# EAGLE design bin_watch (EAGLE 8.4.2)
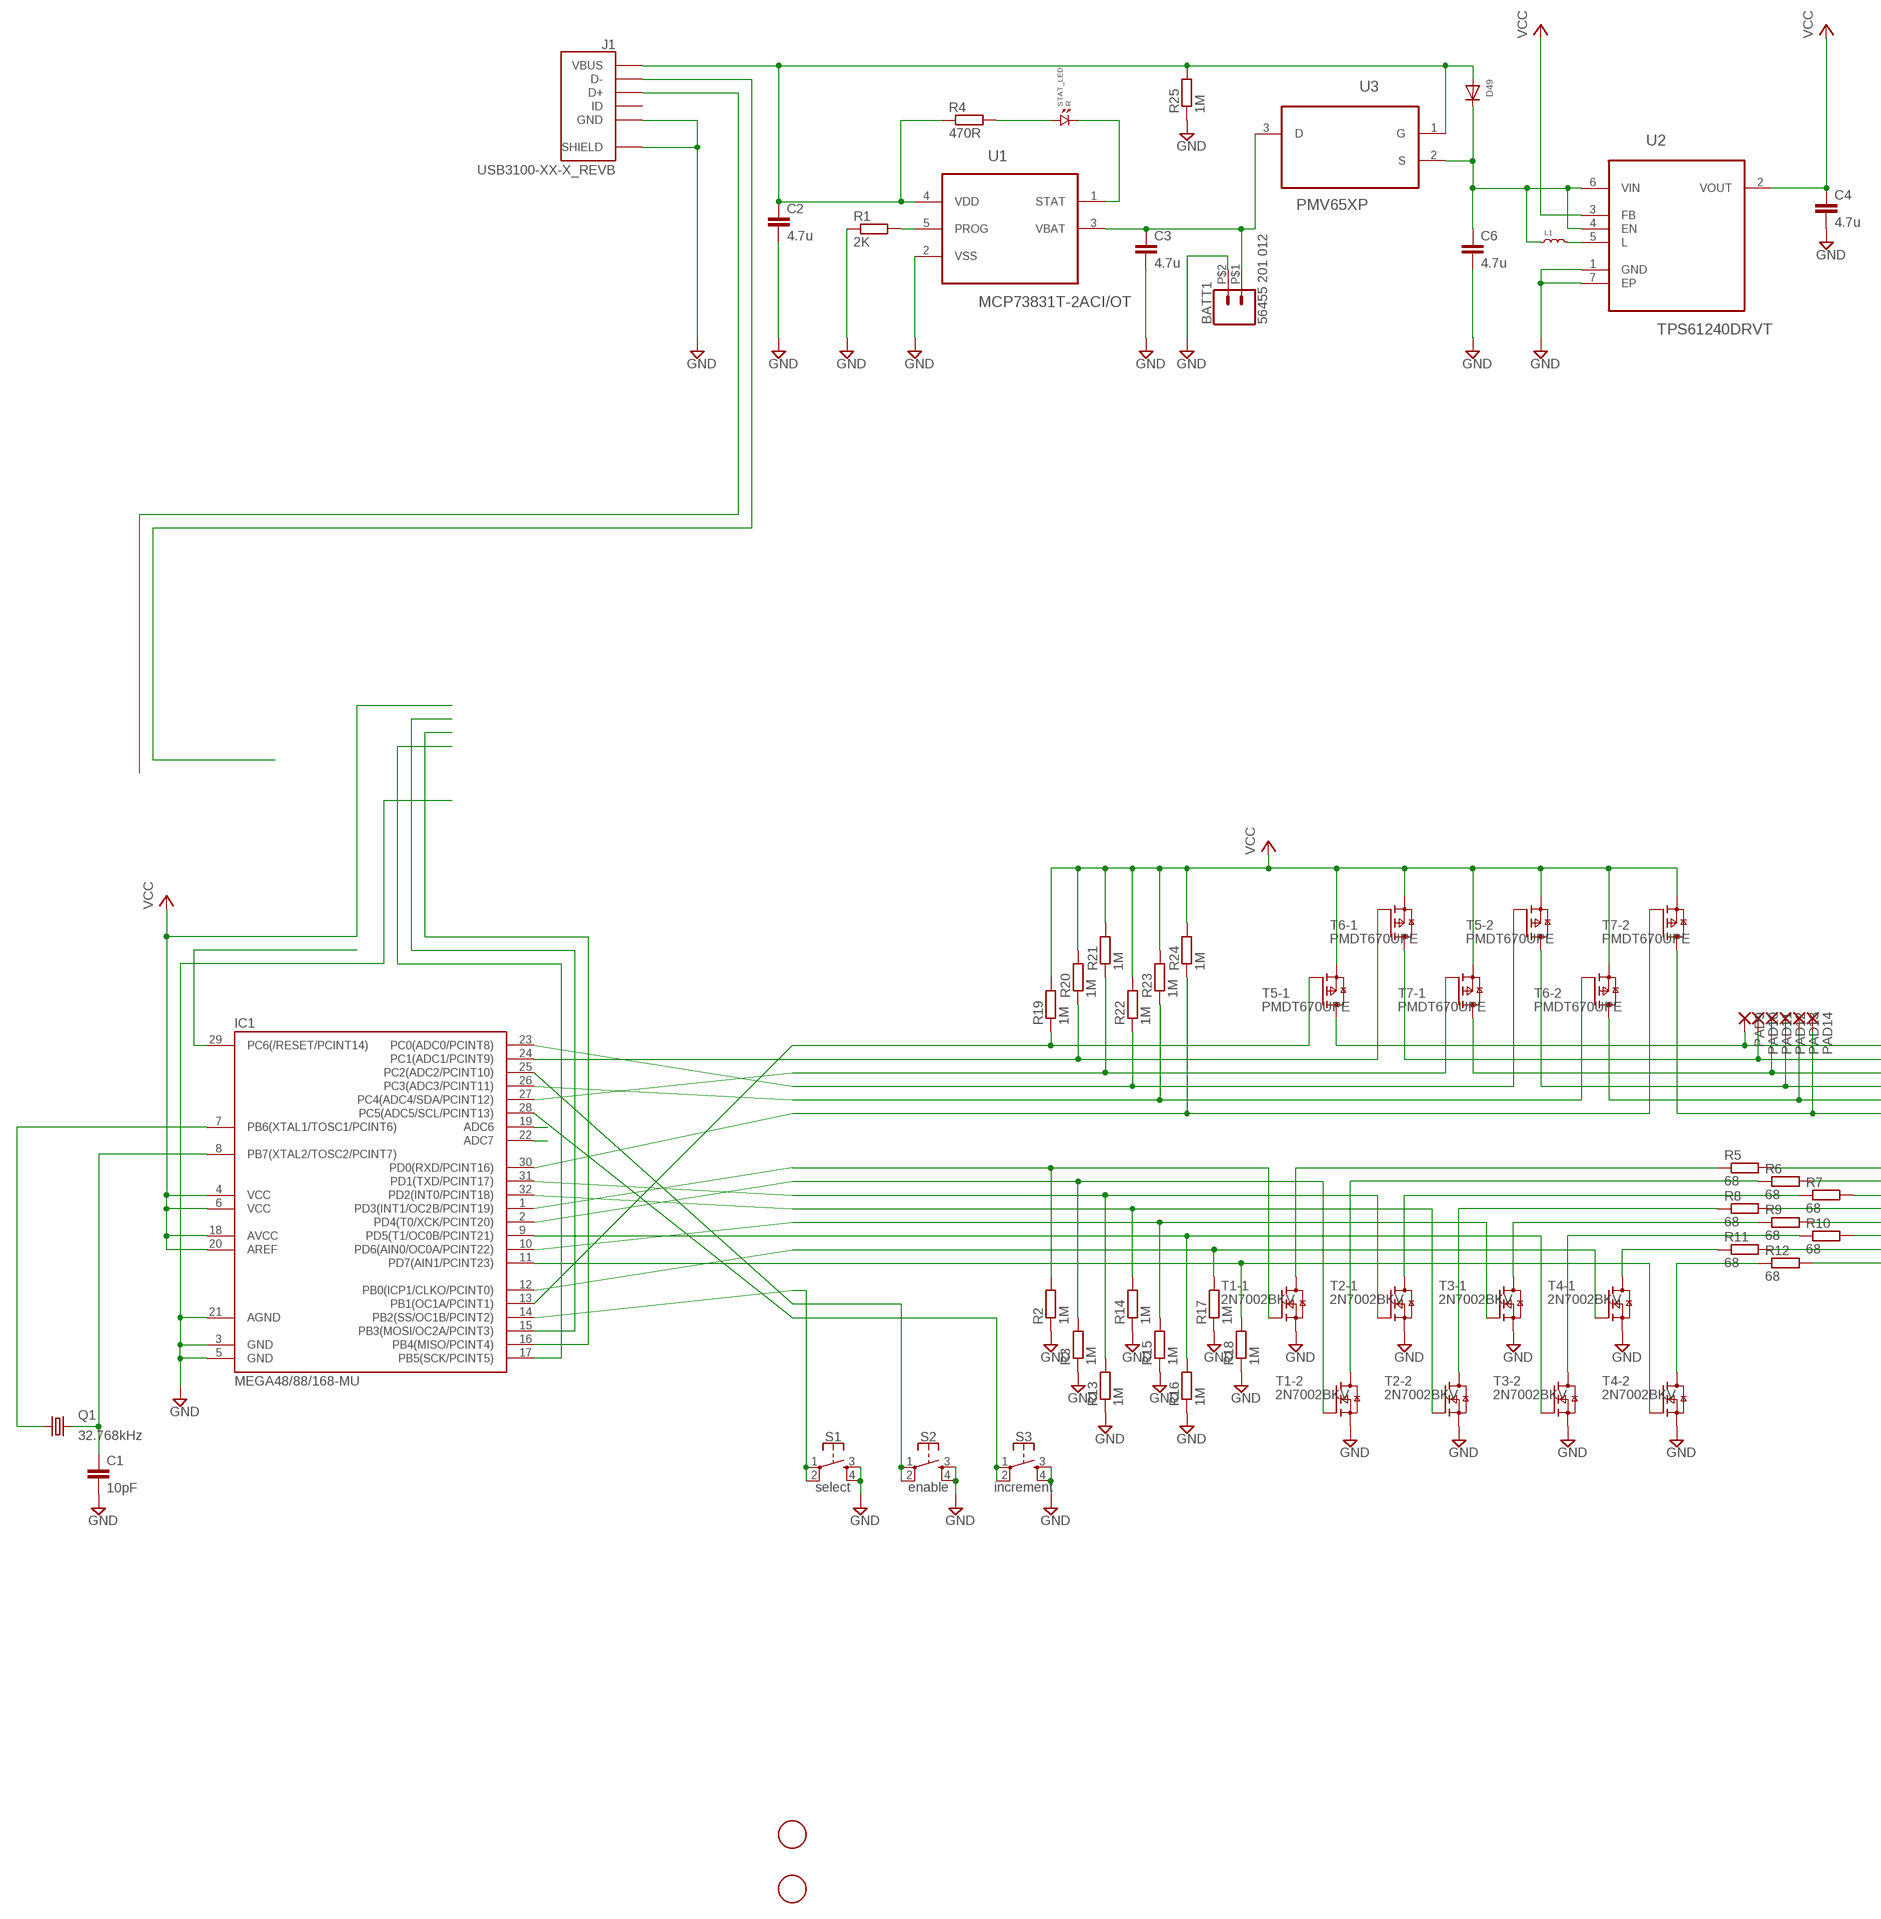
[diagram p0: schematic, sheet 1, part 1 of 2]
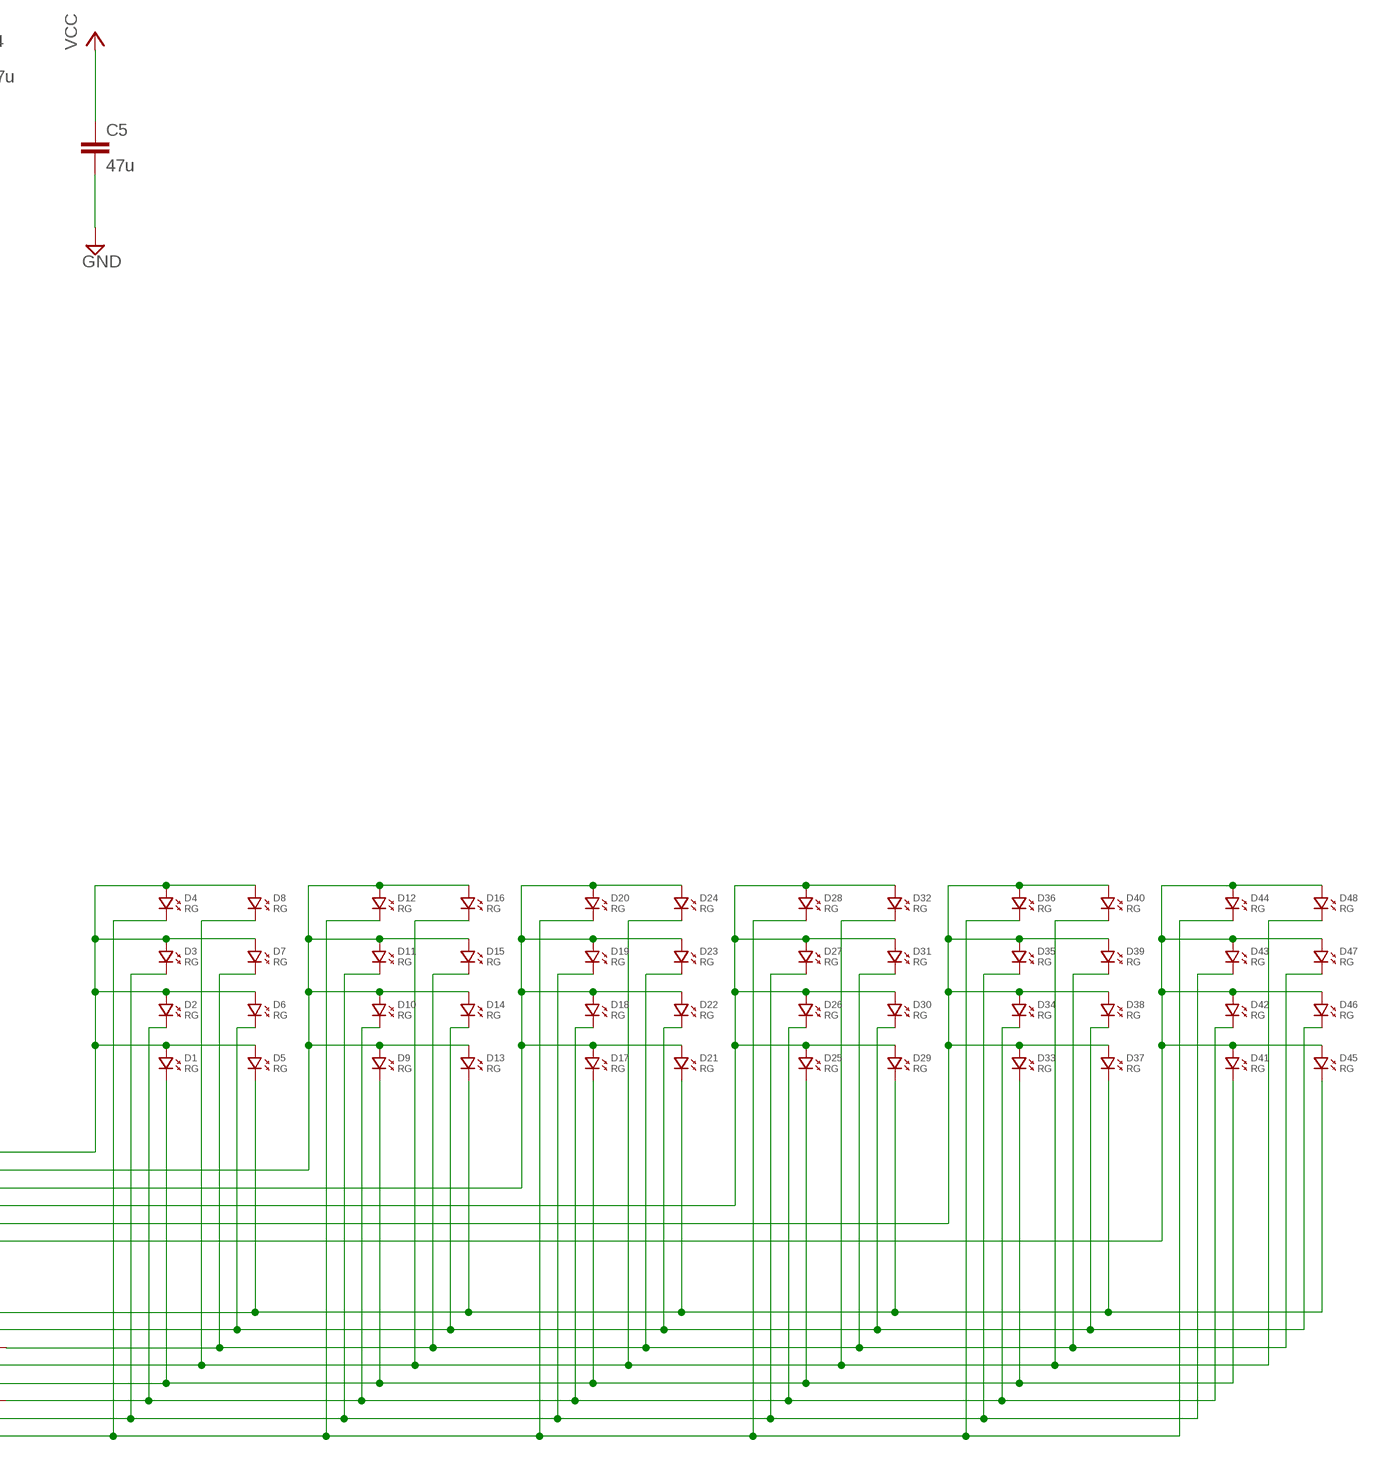
[diagram p1: schematic, sheet 1, part 2 of 2]

## Parts
BATT1  56455 201 012  CONN_02PTH2  [1X02_BIG]
C1  10pF  C-EUC0603  [C0603]
C2  4.7u  C-EUC0603  [C0603]
C3  4.7u  C-EUC0603  [C0603]
C4  4.7u  C-EUC0603  [C0603]
C5  47u  C-EUC0603  [C0603]
C6  4.7u  C-EUC0603  [C0603]
D1  RG  LED.0603  [0603.LED]
D2  RG  LED.0603  [0603.LED]
D3  RG  LED.0603  [0603.LED]
D4  RG  LED.0603  [0603.LED]
D5  RG  LED.0603  [0603.LED]
D6  RG  LED.0603  [0603.LED]
D7  RG  LED.0603  [0603.LED]
D8  RG  LED.0603  [0603.LED]
D9  RG  LED.0603  [0603.LED]
D10  RG  LED.0603  [0603.LED]
D11  RG  LED.0603  [0603.LED]
D12  RG  LED.0603  [0603.LED]
D13  RG  LED.0603  [0603.LED]
D14  RG  LED.0603  [0603.LED]
D15  RG  LED.0603  [0603.LED]
D16  RG  LED.0603  [0603.LED]
D17  RG  LED.0603  [0603.LED]
D18  RG  LED.0603  [0603.LED]
D19  RG  LED.0603  [0603.LED]
D20  RG  LED.0603  [0603.LED]
D21  RG  LED.0603  [0603.LED]
D22  RG  LED.0603  [0603.LED]
D23  RG  LED.0603  [0603.LED]
D24  RG  LED.0603  [0603.LED]
D25  RG  LED.0603  [0603.LED]
D26  RG  LED.0603  [0603.LED]
D27  RG  LED.0603  [0603.LED]
D28  RG  LED.0603  [0603.LED]
D29  RG  LED.0603  [0603.LED]
D30  RG  LED.0603  [0603.LED]
D31  RG  LED.0603  [0603.LED]
D32  RG  LED.0603  [0603.LED]
D33  RG  LED.0603  [0603.LED]
D34  RG  LED.0603  [0603.LED]
D35  RG  LED.0603  [0603.LED]
D36  RG  LED.0603  [0603.LED]
D37  RG  LED.0603  [0603.LED]
D38  RG  LED.0603  [0603.LED]
D39  RG  LED.0603  [0603.LED]
D40  RG  LED.0603  [0603.LED]
D41  RG  LED.0603  [0603.LED]
D42  RG  LED.0603  [0603.LED]
D43  RG  LED.0603  [0603.LED]
D44  RG  LED.0603  [0603.LED]
D45  RG  LED.0603  [0603.LED]
D46  RG  LED.0603  [0603.LED]
D47  RG  LED.0603  [0603.LED]
D48  RG  LED.0603  [0603.LED]
D49  DIODESOD-523  [SOD-523]
IC1  MEGA48/88/168-MU  [MLF32]
J1  USB3100-XX-X_REVB  [GCT_USB3100-XX-X_REVB]
L1  RF-INDUCTOR.0805  [0805]
PAD9  SMD2  [SMD1,27-2,54]
PAD10  SMD2  [SMD1,27-2,54]
PAD11  SMD2  [SMD1,27-2,54]
PAD12  SMD2  [SMD1,27-2,54]
PAD13  SMD2  [SMD1,27-2,54]
PAD14  SMD2  [SMD1,27-2,54]
Q1  32.768kHz  KX-327-NHF  [3.2X1.5]
R1  2K  R-EU_R0603  [R0603]
R2  1M  R-EU_R0603  [R0603]
R3  1M  R-EU_R0603  [R0603]
R4  470R  R-EU_R0603  [R0603]
R5  68  R-EU_R0603  [R0603]
R6  68  R-EU_R0603  [R0603]
R7  68  R-EU_R0603  [R0603]
R8  68  R-EU_R0603  [R0603]
R9  68  R-EU_R0603  [R0603]
R10  68  R-EU_R0603  [R0603]
R11  68  R-EU_R0603  [R0603]
R12  68  R-EU_R0603  [R0603]
R13  1M  R-EU_R0603  [R0603]
R14  1M  R-EU_R0603  [R0603]
R15  1M  R-EU_R0603  [R0603]
R16  1M  R-EU_R0603  [R0603]
R17  1M  R-EU_R0603  [R0603]
R18  1M  R-EU_R0603  [R0603]
R19  1M  R-EU_R0603  [R0603]
R20  1M  R-EU_R0603  [R0603]
R21  1M  R-EU_R0603  [R0603]
R22  1M  R-EU_R0603  [R0603]
R23  1M  R-EU_R0603  [R0603]
R24  1M  R-EU_R0603  [R0603]
R25  1M  R-EU_R0603  [R0603]
S1  select  MOMENTARY-SWITCH-SPST-2-SMD-5.2MM  [TACTILE_SWITCH_SMD_5.2MM]
S2  enable  MOMENTARY-SWITCH-SPST-2-SMD-5.2MM  [TACTILE_SWITCH_SMD_5.2MM]
S3  increment  MOMENTARY-SWITCH-SPST-2-SMD-5.2MM  [TACTILE_SWITCH_SMD_5.2MM]
STAT_LED  R  LED.0603  [0603.LED]
T1  2N7002BKV  [SOT666]
T2  2N7002BKV  [SOT666]
T3  2N7002BKV  [SOT666]
T4  2N7002BKV  [SOT666]
T5  PMDT670UPE  [SOT666]
T6  PMDT670UPE  [SOT666]
T7  PMDT670UPE  [SOT666]
U1  MCP73831T-2ACI/OT  [SOT95P280X145-5N]
U2  TPS61240DRVT  [SON65P200X200X80-7N]
U3  PMV65XP  PMV48XP  [SOT95P230X110-3N]
U$1  FIDUCIAL  [FIDUCIAL_1MM]
U$2  FIDUCIAL  [FIDUCIAL_1MM]

## Nets
ADC6: IC1.19(ADC6)
ADC7: IC1.22(ADC7)
BLOCK0 [pwr]: D1.P$1 D2.P$1 D3.P$1 D4.P$1 D5.P$1 D6.P$1 D7.P$1 D8.P$1 PAD9.1(P) T5.6(-1:D)
BLOCK1 [pwr]: D9.P$1 D10.P$1 D11.P$1 D12.P$1 D13.P$1 D14.P$1 D15.P$1 D16.P$1 PAD10.1(P) T6.6(-1:D)
BLOCK2 [pwr]: D17.P$1 D18.P$1 D19.P$1 D20.P$1 D21.P$1 D22.P$1 D23.P$1 D24.P$1 PAD11.1(P) T7.6(-1:D)
BLOCK3 [pwr]: D25.P$1 D26.P$1 D27.P$1 D28.P$1 D29.P$1 D30.P$1 D31.P$1 D32.P$1 PAD12.1(P) T5.3(-2:D)
BLOCK4 [pwr]: D33.P$1 D34.P$1 D35.P$1 D36.P$1 D37.P$1 D38.P$1 D39.P$1 D40.P$1 PAD13.1(P) T6.3(-2:D)
BLOCK5 [pwr]: D41.P$1 D42.P$1 D43.P$1 D44.P$1 D45.P$1 D46.P$1 D47.P$1 D48.P$1 PAD14.1(P) T7.3(-2:D)
BTN1 [signal]: IC1.14(PB2(SS/OC1B/PCINT2)) S1.1 S1.2
BTN2 [signal]: IC1.25(PC2(ADC2/PCINT10)) S2.1 S2.2
BTN3 [signal]: IC1.28(PC5(ADC5/SCL/PCINT13)) S3.1 S3.2
D_N [signal]: J1.2(D-)
D_P [signal]: J1.3(D+)
G_BLOCK0 [signal]: IC1.13(PB1(OC1A/PCINT1)) R19.1 T5.2(-1:G)
G_BLOCK1 [signal]: IC1.24(PC1(ADC1/PCINT9)) R20.1 T6.2(-1:G)
G_BLOCK2 [signal]: IC1.27(PC4(ADC4/SDA/PCINT12)) R21.1 T7.2(-1:G)
G_BLOCK3 [signal]: IC1.23(PC0(ADC0/PCINT8)) R22.1 T5.5(-2:G)
G_BLOCK4 [signal]: IC1.26(PC3(ADC3/PCINT11)) R23.1 T6.5(-2:G)
G_BLOCK5 [signal]: IC1.30(PD0(RXD/PCINT16)) R24.1 T7.5(-2:G)
G_LIGHT0 [signal]: IC1.1(PD3(INT1/OC2B/PCINT19)) R2.2 T1.2(-1:G)
G_LIGHT1 [signal]: IC1.2(PD4(T0/XCK/PCINT20)) R3.2 T1.5(-2:G)
G_LIGHT2 [signal]: IC1.31(PD1(TXD/PCINT17)) R13.2 T2.2(-1:G)
G_LIGHT3 [signal]: IC1.32(PD2(INT0/PCINT18)) R14.2 T2.5(-2:G)
G_LIGHT4 [signal]: IC1.10(PD6(AIN0/OC0A/PCINT22)) R15.2 T3.2(-1:G)
G_LIGHT5 [signal]: IC1.9(PD5(T1/OC0B/PCINT21)) R16.2 T3.5(-2:G)
G_LIGHT6 [signal]: IC1.12(PB0(ICP1/CLKO/PCINT0)) R17.2 T4.2(-1:G)
G_LIGHT7 [signal]: IC1.11(PD7(AIN1/PCINT23)) R18.2 T4.5(-2:G)
GND [supply]: BATT1.P$2 C1.2 C2.2 C3.2 C4.2 C5.2 C6.2 IC1.3(GND) IC1.5(GND) IC1.21(AGND) J1.5(GND) J1.6(SHIELD) J1.7(SHIELD) J1.8(SHIELD) J1.9(SHIELD) R1.1 R2.1 R3.1 R13.1 R14.1 R15.1 R16.1 R17.1 R18.1 R25.1 S1.3 S1.4 S2.3 S2.4 S3.3 S3.4 T1.1(-1:S) T1.4(-2:S) T2.1(-1:S) T2.4(-2:S) T3.1(-1:S) T3.4(-2:S) T4.1(-1:S) T4.4(-2:S) U1.2(VSS) U2.1(GND) U2.7(EP)
L [pwr]: L1.2 U2.5(L)
LIGHT0: D5.P$2 D13.P$2 D21.P$2 D29.P$2 D37.P$2 D45.P$2 R5.2
LIGHT1: D6.P$2 D14.P$2 D22.P$2 D30.P$2 D38.P$2 D46.P$2 R6.2
LIGHT2: D7.P$2 D15.P$2 D23.P$2 D31.P$2 D39.P$2 D47.P$2 R7.2
LIGHT3: D8.P$2 D16.P$2 D24.P$2 D32.P$2 D40.P$2 D48.P$2 R8.2
LIGHT4: D1.P$2 D9.P$2 D17.P$2 D25.P$2 D33.P$2 D41.P$2 R9.2
LIGHT5: D2.P$2 D10.P$2 D18.P$2 D26.P$2 D34.P$2 D42.P$2 R10.2
LIGHT6: D3.P$2 D11.P$2 D19.P$2 D27.P$2 D35.P$2 D43.P$2 R11.2
LIGHT7: D4.P$2 D12.P$2 D20.P$2 D28.P$2 D36.P$2 D44.P$2 R12.2
MISO [signal]: IC1.16(PB4(MISO/PCINT4))
MOSI [signal]: IC1.15(PB3(MOSI/OC2A/PCINT3))
PROG [signal]: R1.2 U1.5(PROG)
R_LIGHT0: R5.1 T1.6(-1:D)
R_LIGHT1: R6.1 T1.3(-2:D)
R_LIGHT2: R7.1 T2.6(-1:D)
R_LIGHT3: R8.1 T2.3(-2:D)
R_LIGHT4: R9.1 T3.6(-1:D)
R_LIGHT5: R10.1 T3.3(-2:D)
R_LIGHT6: R11.1 T4.6(-1:D)
R_LIGHT7: R12.1 T4.3(-2:D)
RST [signal]: IC1.29(PC6(/RESET/PCINT14))
SCK [signal]: IC1.17(PB5(SCK/PCINT5))
STAT: STAT_LED.P$2 U1.1(STAT)
STAT_R: R4.2 STAT_LED.P$1
VBATT [supply]: BATT1.P$1 C3.1 U1.3(VBAT) U3.3(D)
VBUS [supply]: C2.1 D49.A J1.1(VBUS) R4.1 R25.2 U1.4(VDD) U3.1(G)
VCC [supply]: C4.1 C5.1 IC1.4(VCC) IC1.6(VCC) IC1.18(AVCC) IC1.20(AREF) R19.2 R20.2 R21.2 R22.2 R23.2 R24.2 T5.1(-1:S) T5.4(-2:S) T6.1(-1:S) T6.4(-2:S) T7.1(-1:S) T7.4(-2:S) U2.2(VOUT) U2.3(FB)
VIN [supply]: C6.1 D49.K(C) L1.1 U2.4(EN) U2.6(VIN) U3.2(S)
XTAL_N [clock]: C1.1 IC1.8(PB7(XTAL2/TOSC2/PCINT7)) Q1.2
XTAL_P [clock]: IC1.7(PB6(XTAL1/TOSC1/PCINT6)) Q1.1
Unconnected: J1.4(ID)

## Library data of the parts
BATT1 = SparkFun-Connectors:CONN_02: Multi connection point. Often used as Generic Header-pin footprint for 0.1 inch spaced/style header connections On any of the 0.1 inch spaced packages, you can populate with these: Break Away Headers - Straight <https://www.sparkfun.com/products/116> (PRT-00116) Break Away Male Headers - Right Angle <https://www.sparkfun.com/products/553> (PRT-00553) Female Headers <https://www.sparkfun.com/products/115> (PRT-00115) Break Away Headers - Machine Pin <https://www.sparkfun.com/products/117> (PRT-00117) Break Away Female Headers - Swiss Machine Pin <https://www.sparkfun.com/products/743> (PRT-00743) For SCREWTERMINALS and SPRING TERMINALS visit here: Screw Terimnals on SparkFun.com <https://www.sparkfun.com/search/results?term=Screw+Terminals> (5mm/3.5mm/2.54mm spacing) This device is also useful as a general connection point to wire up your design to another part of your project. Our various solder wires solder well into these plated through hole pads. Hook-Up Wire - Assortment (Stranded, 22 AWG) <https://www.sparkfun.com/products/11375> (PRT-11375) Hook-Up Wire - Assortment (Solid Core, 22 AWG) <https://www.sparkfun.com/products/11367> (PRT-11367) View the entire wire category on our website here <https://www.sparkfun.com/categories/141> Special notes: Molex polarized connector foot print use with: PRT-08233 with associated crimp pins and housings. 2.54_SCREWTERM for use with PRT-10571. 3.5mm Screw Terminal footprints for PRT-08084 5mm Screw Terminal footprints for use with PRT-08432
C1-C6 = rcl:C-EU: CAPACITOR, European symbol
D1-D48 STAT_LED = standardparts:LED
D49 = adafruit:DIODE: Diode SMADIODE - SMA Surface Mount Package 20V 1A Schottky Diode Digikey: 641-1014-6-ND DO-1N4148 - Through Hole Small Current Diode SOD-123 20V 1 A (.5mV Vf) Schottky Diode - Digikey: MBRX120TPMSCT-ND SOD-323 10V 570mA (.38mV Vf, 3ns) Schottky Diode - Digikey: ZLLS410CT-ND SOD-523 30V 30mA Schottky Diode (RB751S-40TE61) - Digikey: RB751S-40TE61CT-ND SOT23-R/W - SOT23 Package (R = Solder Paste/Reflow Ovens, W = Hand-Soldering) BAT54Film 40V 300mA - Digikey: 497-7162-1-ND
IC1 = avr-5:MEGA48/88/168
J1 = USB3100-XX-X_REVB:USB3100-XX-X_REVB: Micro USB Receptacle, Type B, Surface Mount, Horizontal, Top (Reverse) Mount, without Peg; AVAILABILITY: Good; DESCRIPTION: USB3100 Series 5 Pin SMT Right Angle Top Mount Micro USB Receptacle; MF: Global Connector Technology; MP: USB3100-30-A; PACKAGE: None; PRICE: 0.39 USD
L1 = standardparts:RF-INDUCTOR
PAD9-PAD14 = wirepad:SMD2: SMD PAD
Q1 = crystal-geyer_V1_0:KX-327: Tuning Fork Crystals (kHz) SMD: KX327 - Serie Model Size l/w/h [mm] Frequency Range Frequency Stability Temp. Range [°C] Load Capacitance AECQ 200 availabel Datasheet KX-327VT KX-327FT KX-327RT KX-327NHT KX-327NHF KX-327L KX-327S 1.25/1.05/0.5 1.6/1.0/0.5 2.0/1.2/0.6 3.2/1.5/0.8 3.2/1.5/0.8 7.0/1.5/1.4 8.2/3.8/2.5 32,768 kHz 32,768 kHz 32,768 kHz 32,768 kHz 32,768 kHz 32,768 kHz 32,768 kHz ±10 … ±20ppm ±10 … ±20ppm ±10 … ±20ppm ±10 … ±20ppm ±10 … ±20ppm ±10 … ±20ppm ±5 … ±20ppm (*) -40°C …+85°C (*) -40°C …+85°C (*) -40°C …+85°C (*) -40°C …+85°C (*) -40°C …+125°C (*) -40°C …+85°C (*) -40°C …+85°C 7/9/12,5 7/9/12,5 7/9/12,6 7/9/12,5 9/12,5 7/9/12,5 6/12,5 - - - - yes - - KX-327VT.pdf <http://www.geyer-electronic.de/uploads/tx_userartikelfrequenz/GEYER-KX-327VT.pdf> KX-327FT.pdf <http://www.geyer-electronic.de/uploads/tx_userartikelfrequenz/GEYER-KX-327FT.pdf> KX-327RT.pdf <http://www.geyer-electronic.de/uploads/tx_userartikelfrequenz/GEYER-KX-327RT.pdf> KX-327NHT.pdf <http://www.geyer-electronic.de/uploads/tx_userartikelfrequenz/GEYER-KX-327NHT.pdf> KX-327NHF.pdf <http://www.geyer-electronic.de/uploads/tx_userartikelfrequenz/GEYER-KX-327NHF.pdf> KX-327L.pdf <http://www.geyer-electronic.de/uploads/tx_userartikelfrequenz/GEYER-KX-327L.pdf> KX-327S.pdf <http://www.geyer-electronic.de/uploads/tx_userartikelfrequenz/GEYER-KX-327S.pdf> <http://www.geyer-electronic.de/fileadmin/template/img/logo-geyer-electronic.png> Details see: http://www.geyer-electronic.de/Frequenz-Produkte.9.0.html Created 2016-06-07, Hans Locher 2016 (C) Geyer Quartz Technology KX327VT,KX327FT,KX327RT,KX327NHT,KX327NHF,KX327S,KX327L;125105;1610;2012;3215;7015;8238;1,25x1,05,1.25x1.05;1,6x1,0,1.6x1.0;2,0x1,2,2.0x1.2;3,2x1,5,3.2x1.5;8,2x3,8,8.2x3.8,7.0x1.5,7,0x1,532.768kHz
R1-R25 = rcl:R-EU_: RESISTOR, European symbol
S1-S3 = SparkFun-Switches:MOMENTARY-SWITCH-SPST-2: Momentary Switch (Pushbutton) - SPST - Two Circuits Normally-open (NO) SPST momentary switches (buttons, pushbuttons). Schematic symbol includes two switch circuits. Variants SMD-4.6MMX2.8MM - 4.60mm x 2.80mm Tactile Momentary Button Switch - Used on SparkFun SAMD21 Mini Breakout <https://www.sparkfun.com/products/13664> SMD-5.2MM - Mini Pushbutton Switch - SMD <https://www.sparkfun.com/products/8720> - Used on Arduino Pro Mini <https://www.sparkfun.com/products/11114>; PROD_ID: SWCH-08247; SF_SKU: COM-08720
T1-T4 = nxp_60:2N7002BK: 60 V, 340 mA dual N-channel Trench MOSFET Dual N-channel enhancement mode Field-Effect Transistor (FET) in an ultra small SOT666 Surface-Mounted Device (SMD) plastic package using Trench MOSFET technology. AAL Eindhoven MK
T5-T7 = nxp_60:PMDT670UPE: Dual P-channel MOSFET Package: SOT-666
U1 = Microchip_By_element14_Batch_1:MCP73831T-2ACI/OT: Charge Management Controller; MPN: MCP73831T-2ACI/OT; OC_FARNELL: 1332158; OC_NEWARK: 56K7045; PACKAGE: SOT-5; SUPPLIER: Microchip
U2 = Texas Instruments_By_element14_Batch_1:TPS61240DRVT: 3.5-MHz High Efficiency Step-Up Converter; MPN: TPS61240DRVT; OC_FARNELL: 1903400; OC_NEWARK: 25R0114; PACKAGE: SON-6; SUPPLIER: Texas Instruments
U3 = NXP_By_element14_Batch_1:PMV48XP: P-channel Trench MOSFET; MPN: PMV48XP; OC_FARNELL: 1894743; OC_NEWARK: 55T6958; PACKAGE: SOT-3; SUPPLIER: NXP
U$1 U$2 = adafruit:FIDUCIAL: For use by pick and place machines to calibrate the vision/machine, 1mm By microbuilder.eu

## Net classes
0 default: width 0.16 mm, drill 0.3 mm, clearance 0.16 mm
1 supply: width 0.2 mm, drill 0.35 mm, clearance 0.2 mm
2 clock: width 0.15 mm, drill 0.254 mm, clearance 0.2 mm
3 pwr: width 0.2 mm, drill 0.35 mm, clearance 0.2 mm
4 signal: width 0.13 mm, drill 0.254 mm, clearance 0.13 mm

## Board
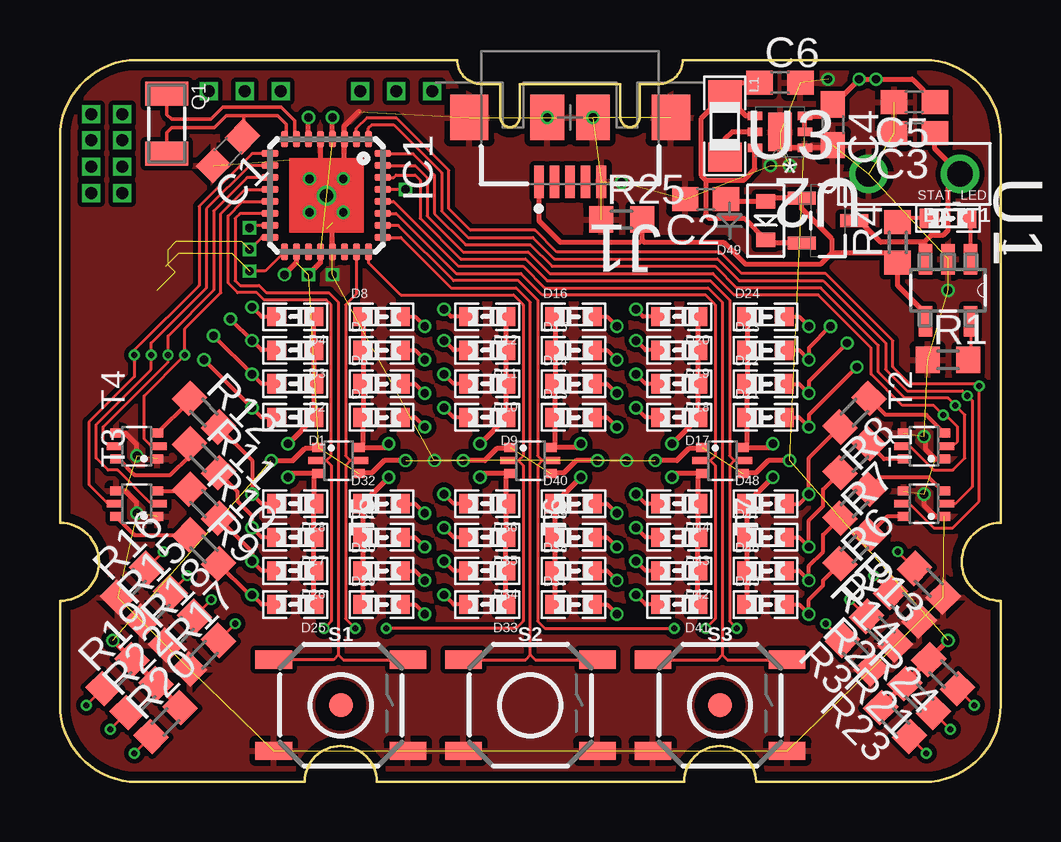
[diagram p2: board, top side]
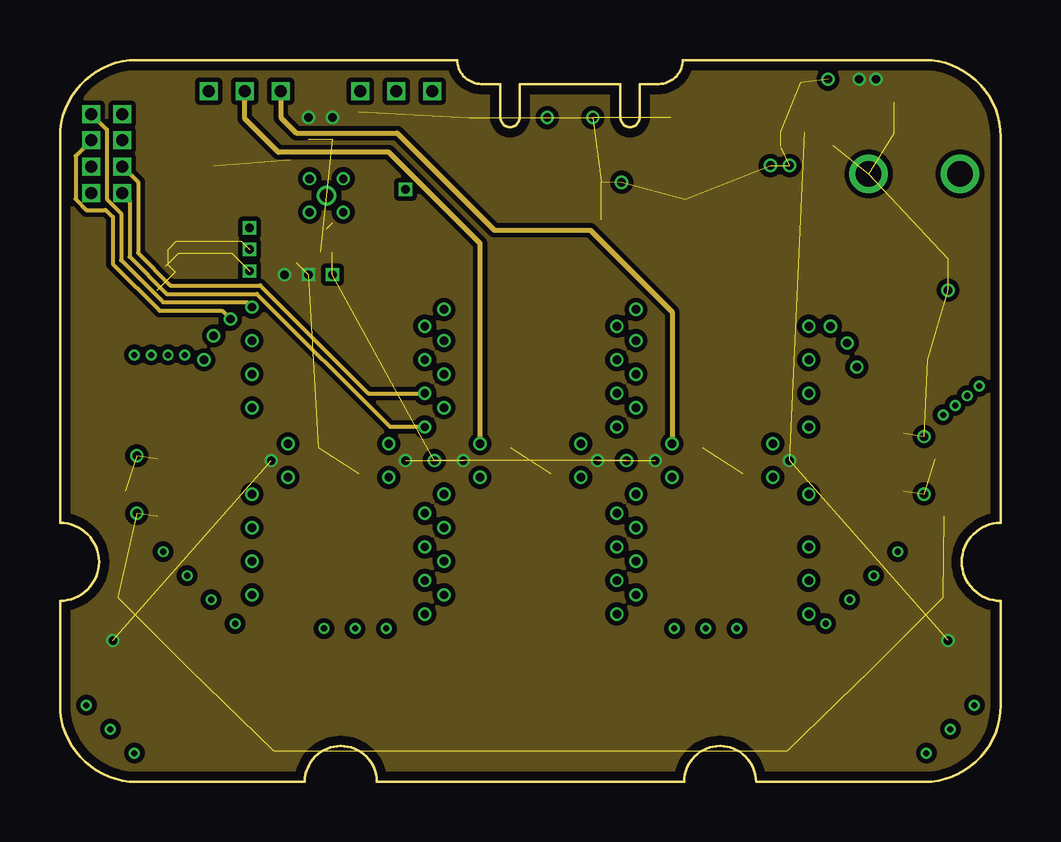
[diagram p3: board, inner layer Route2]
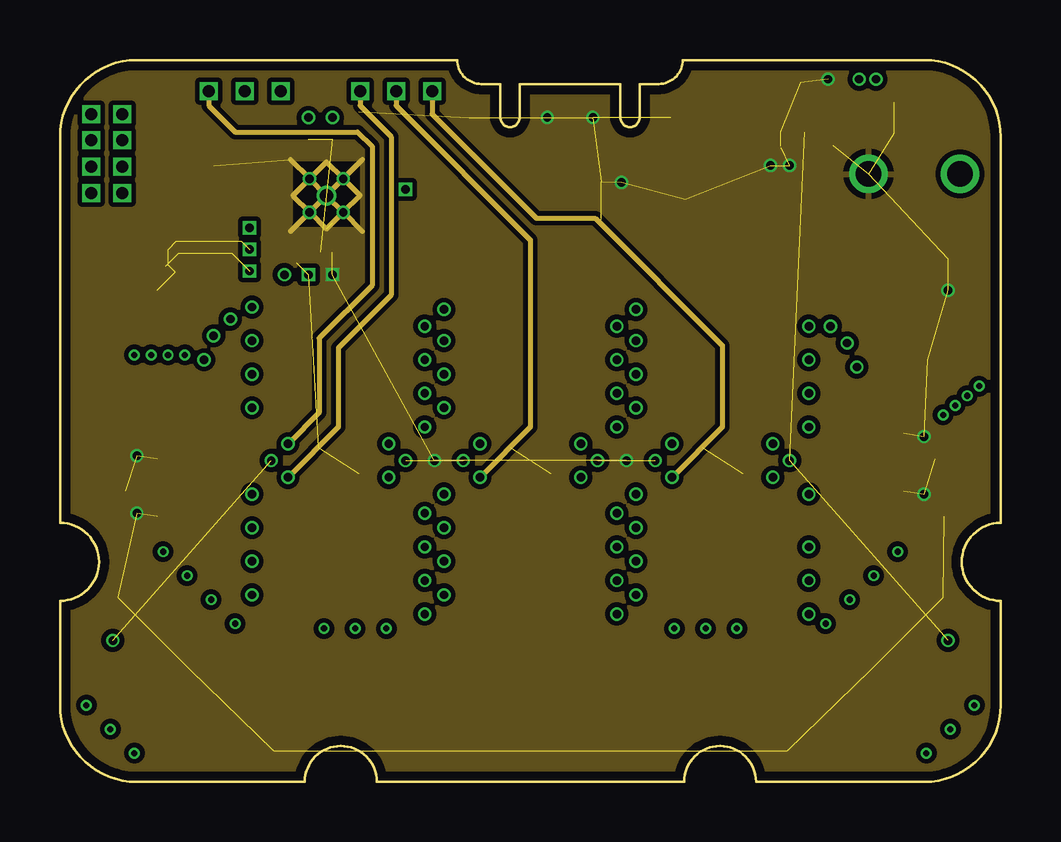
[diagram p4: board, inner layer Route15]
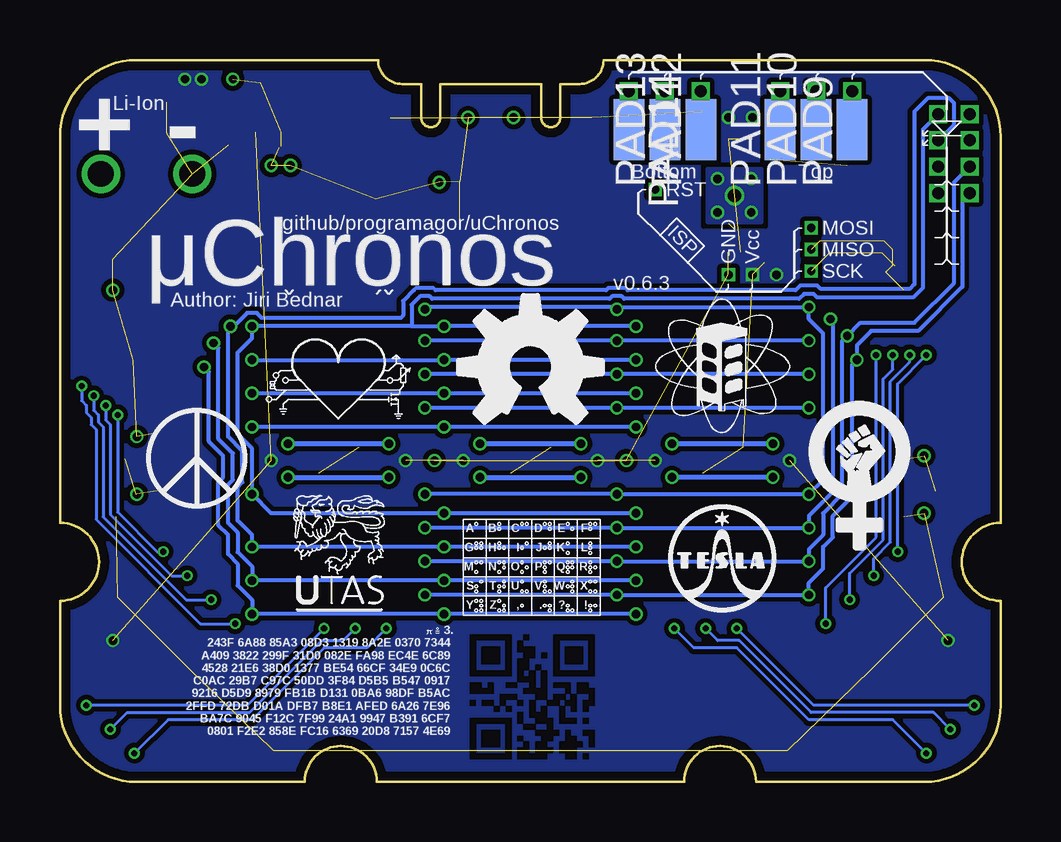
[diagram p5: board, bottom side, seen from below]

Size 39.2 x 30.1 mm. Coordinates in mm from the lower left corner, seen from the top.
Outline: 3.2,30.1 16.55,30.1 arc90 17.55,29.1 18.35,29.1 18.35,27.7 arc180 19.15,27.7 19.15,29.1 23.35,29.1 23.35,27.7 arc180 24.15,27.7 24.15,29.1 24.95,29.1 arc90 25.95,30.1 36,30.1 arc-90 39.2,26.9 39.2,10.8 arc180 39.2,7.55 39.2,3.2 arc-90 36,0 29,0 arc180 26,0 13.2,0 arc180 10.2,0 3.2,0 arc-90 0,3.2 0,7.55 arc180 0,10.8 0,26.9 arc-90 3.2,30.1
Copper layers (1*2*15*16): Top 0.035559375mm / dielectric 0.17018125mm / Route2 0.01778125mm / dielectric 47mil / Route15 0.01778125mm / dielectric 0.17018125mm / Bottom 0.035559375mm
Design rules "OSHPark-4layer *": minimum track width 5mil, minimum drill 10mil, track to track 5mil, track to pad 5mil, pad to pad 5mil, via to via 5mil, smd to smd 5mil, copper to edge 15mil, drill to drill 6mil, minimum pad ring 4mil, minimum via ring 4mil, stop-mask expansion 2.5mil, vias tented up to drill 0.35mm, thermal gap 10mil
bRestrict: area 16.9,4.4 to 17.2,6.1; area 17.2,4.4 to 18.7,4.7; area 18.4,4.7 to 18.7,6.1; area 17.2,5.9 to 18.4,6.1; area 17.4,4.9 to 18.2,5.6; area 20.4,4.4 to 20.6,6.1; area 21.9,4.4 to 22.1,6.1; area 20.6,4.4 to 21.9,4.7; area 20.6,5.9 to 21.9,6.1; area 20.9,4.9 to 21.6,5.6; area 20.4,2.4 to 22.1,2.7; area 20.4,0.9 to 20.6,2.4; 60 more areas

### Footprints (pad centres in the part's own frame; a part is rotated, then mirrored left to right if it is on the bottom)
1X02_BIG = drill 1.067: P$1 0,0; P$2 3.81,0
C0603 = smd 1.1 x 1: 1 -0.85,0; 2 0.85,0
0603.LED = smd 0.8 x 0.8: P$1 -0.775,0; P$2 0.775,0
SOD-523 = smd 0.8 x 0.6: A 0,-0.8; K 0,0.8
MLF32 = smd 0.7 x 0.3: 1 -2.35,1.75; 2 -2.35,1.25; 3 -2.35,0.75; 4 -2.35,0.25; 5 -2.35,-0.25; 6 -2.35,-0.75; 7 -2.35,-1.25; 8 -2.35,-1.75; 17 2.35,-1.75; 18 2.35,-1.25; 19 2.35,-0.75; 20 2.35,-0.25; 21 2.35,0.25; 22 2.35,0.75; 23 2.35,1.25; 24 2.35,1.75 | smd 0.3 x 0.7: 9 -1.75,-2.35; 10 -1.25,-2.35; 11 -0.75,-2.35; 12 -0.25,-2.35; 13 0.25,-2.35; 14 0.75,-2.35; 15 1.25,-2.35; 16 1.75,-2.35; 25 1.75,2.35; 26 1.25,2.35; 27 0.75,2.35; 28 0.25,2.35; 29 -0.25,2.35; 30 -0.75,2.35; 31 -1.25,2.35; 32 -1.75,2.35
GCT_USB3100-XX-X_REVB = smd 0.4 x 1.35: 1 1.3,2.675; 2 0.65,2.675; 3 0,2.675; 4 -0.65,2.675; 5 -1.3,2.675 | smd 1.4 x 1.9: 6 -0.95,0; 7 0.95,0 | smd 1.6 x 1.9: 8 -4.2,0; 9 4.2,0
0805 = smd 1.2 x 1.4: 1 -1.3,0; 2 1.3,0
SMD1,27-2,54 = smd 1.27 x 2.54: 1 0,0
3.2X1.5 = smd 1 x 1.8: 1 -1.25,0; 2 1.25,0
R0603 = smd 1 x 1.1: 1 -0.85,0; 2 0.85,0
TACTILE_SWITCH_SMD_5.2MM = smd 1.524 x 0.762: 1 -2.794,1.905; 2 2.794,1.905; 3 -2.794,-1.905; 4 2.794,-1.905
SOT666 = smd 0.375 x 0.5: 1 -0.537,-0.85; 3 0.538,-0.85; 4 0.538,0.85; 6 -0.538,0.85 | smd 0.3 x 0.65: 2 0,-0.925; 5 0,0.925
SOT95P280X145-5N = smd 1.27 x 0.559: 1 -1.295,0.94; 2 -1.295,0; 3 -1.295,-0.94; 4 1.295,-0.94; 5 1.295,0.94
SON65P200X200X80-7N = smd 0.61 x 0.356: 1 -1.041,0.66; 2 -1.041,0; 3 -1.041,-0.66; 4 1.041,-0.66; 5 1.041,0; 6 1.041,0.66 | smd 0.991 x 1.6: 7 0,0
SOT95P230X110-3N = smd 1.168 x 0.533: 1 -1.092,0.94; 2 -1.092,-0.94; 3 1.092,0
FIDUCIAL_1MM = smd 1 x 1: 1 0,0

### Placement (x,y rotation side)
BATT1  37.5,25.35 180 top
C1  7,26.3 225 top
C2  26.9,24.3 180 top
C3  35.6,27.05 180 top
C4  32.2,27.4 270 top
C5  35.6,28.35 180 top
C6  30,29.15 0 top
D1  9.8,15.2 180 top
D2  9.8,16.6 180 top
D3  9.8,18 180 top
D4  9.8,19.4 180 top
D5  13.4,15.2 0 top
D6  13.4,16.6 0 top
D7  13.4,18 0 top
D8  13.4,19.4 0 top
D9  17.8,15.2 180 top
D10  17.8,16.6 180 top
D11  17.8,18 180 top
D12  17.8,19.4 180 top
D13  21.4,15.2 0 top
D14  21.4,16.6 0 top
D15  21.4,18 0 top
D16  21.4,19.4 0 top
D17  25.8,15.2 180 top
D18  25.8,16.6 180 top
D19  25.8,18 180 top
D20  25.8,19.4 180 top
D21  29.4,15.2 0 top
D22  29.4,16.6 0 top
D23  29.4,18 0 top
D24  29.4,19.4 0 top
D25  9.8,7.4 180 top
D26  9.8,8.8 180 top
D27  9.8,10.2 180 top
D28  9.8,11.6 180 top
D29  13.4,7.4 0 top
D30  13.4,8.8 0 top
D31  13.4,10.2 0 top
D32  13.4,11.6 0 top
D33  17.8,7.4 180 top
D34  17.8,8.8 180 top
D35  17.8,10.2 180 top
D36  17.8,11.6 180 top
D37  21.4,7.4 0 top
D38  21.4,8.8 0 top
D39  21.4,10.2 0 top
D40  21.4,11.6 0 top
D41  25.8,7.4 180 top
D42  25.8,8.8 180 top
D43  25.8,10.2 180 top
D44  25.8,11.6 180 top
D45  29.4,7.4 0 top
D46  29.4,8.8 0 top
D47  29.4,10.2 0 top
D48  29.4,11.6 0 top
D49  29.4,23.4 180 top
IC1  11.1,24.45 270 top
J1  21.25,27.7 180 top
L1  27.7,27.35 270 top
PAD9  6.2,27.2 0 bottom
PAD10  7.7,27.2 0 bottom
PAD11  9.2,27.2 0 bottom
PAD12  12.5,27.2 0 bottom
PAD13  14,27.2 0 bottom
PAD14  15.5,27.2 180 bottom
Q1  4.45,27.45 270 top
R1  37,17.6 0 top
R2  34.2,6.3 135 top
R3  33.2,5.3 135 top
R4  34.9,22.5 90 top
R5  33.1,9.7 225 top
R6  33.1,11.6 225 top
R7  33.1,13.5 225 top
R8  33.1,15.4 225 top
R9  6,9.7 315 top
R10  6,11.6 315 top
R11  6,13.5 315 top
R12  6,15.4 315 top
R13  36.2,8.3 135 top
R14  35.2,7.3 135 top
R15  4,7.3 45 top
R16  3,8.3 45 top
R17  6,5.3 45 top
R18  5,6.3 45 top
R19  2.4,4.5 45 top
R20  4.4,2.5 45 top
R21  35.8,3.5 135 top
R22  3.4,3.5 45 top
R23  34.8,2.5 135 top
R24  36.8,4.5 135 top
R25  23.4,23.45 0 top
S1  11.7,3.2 0 top
S2  19.6,3.2 0 top
S3  27.5,3.2 0 top
STAT_LED  37,23.5 0 top
T1  36,11.6 90 top
T2  36,14 90 top
T3  3.2,11.6 90 top
T4  3.2,14 90 top
T5  11.6,13.4 270 top
T6  19.6,13.4 270 top
T7  27.6,13.4 270 top
U1  37,20.5 270 top
U2  30,27.1 180 top
U3  32,23.4 0 top
U$1  11.7,3.2 0 top
U$2  27.5,3.2 0 top

### Tracks (layer width: path | path; a pad name or v marks a point on that pad's centre or on a via)
BLOCK0  (via drill 0.35, 0.5)
  Top 0.2: D8.P$1 D7.P$1 D6.P$1 D5.P$1 | D5.P$1 12.62,14.11 T5.6 13.54,13.94 v13.7,14.1 | v9.5,14.1 10.57,15.18 D1.P$1 D2.P$1 D3.P$1 D4.P$1 | D5.P$1 12.62,15.18
  Route15 0.2: v6.2,28.8 6.2,28.2 7.3,27.1 12.4,27.1 13,26.5 13,20.7 10.8,18.5 10.8,15.4 v9.5,14.1
  Bottom 0.2: v9.5,14.1 v13.7,14.1 | PAD9.1 v6.2,28.8
BLOCK1  (via drill 0.35, 0.5)
  Top 0.2: v17.5,14.1 18.57,15.18 D9.P$1 D10.P$1 D11.P$1 D12.P$1 | v21.7,14.1 21.54,13.94 T6.6 20.62,14.11 D13.P$1 D14.P$1 D15.P$1 D16.P$1
  Route2 0.2: v17.5,14.1 17.5,22.45 13.7,26.25 9.1,26.25 7.7,27.65 v7.7,28.8
  Bottom 0.2: v17.5,14.1 v21.7,14.1 | PAD10.1 v7.7,28.8
BLOCK2  (via drill 0.35, 0.5)
  Top 0.2: D24.P$1 D23.P$1 D22.P$1 D21.P$1 28.62,14.11 T7.6 29.54,13.94 v29.7,14.1 | D20.P$1 D19.P$1 D18.P$1 D17.P$1 26.38,14.97 v25.5,14.1
  Route2 0.2: v9.2,28.8 9.2,27.7 9.85,27.05 14.05,27.05 18.1,23 22.1,23 25.5,19.6 v25.5,14.1
  Bottom 0.2: v25.5,14.1 v29.7,14.1 | PAD11.1 v9.2,28.8
BLOCK3  (via drill 0.35, 0.5)
  Top 0.2: D29.P$1 D30.P$1 D31.P$1 D32.P$1 12.62,11.62 v13.7,12.7 | D25.P$1 D26.P$1 D27.P$1 D28.P$1 10.57,12.69 T5.3 9.66,12.86 v9.5,12.7
  Route15 0.2: v12.5,28.8 12.5,28.2 13.8,26.9 13.8,20.3 11.6,18.1 11.6,14.8 v9.5,12.7
  Bottom 0.2: v9.5,12.7 v13.7,12.7 | PAD12.1 v12.5,28.8
BLOCK4  (via drill 0.35, 0.5)
  Top 0.2: v21.7,12.7 20.62,11.62 D40.P$1 D39.P$1 D38.P$1 D37.P$1 | v17.5,12.7 17.66,12.86 T6.3 18.57,12.69 D36.P$1 D35.P$1 D34.P$1 D33.P$1
  Route15 0.2: v14,28.8 14,28.2 19.6,22.6 19.6,14.8 v17.5,12.7
  Bottom 0.2: v21.7,12.7 v17.5,12.7 | PAD13.1 v14,28.8
BLOCK5  (via drill 0.35, 0.5)
  Top 0.2: D41.P$1 D42.P$1 D43.P$1 D44.P$1 26.57,12.69 T7.3 25.66,12.86 v25.5,12.7 | D45.P$1 D46.P$1 D47.P$1 D48.P$1 28.62,11.62 v29.7,12.7
  Route15 0.2: v15.5,28.8 15.5,27.85 19.85,23.5 22.3,23.5 27.6,18.2 27.6,14.8 v25.5,12.7
  Bottom 0.2: v29.7,12.7 v25.5,12.7 | PAD14.1 v15.5,28.8
BTN1
  Top 0.13: 11.6,5.3 11.6,20 11.2,20.4 8.6,20.4 8.3,20.7 7.5,20.7 7.3,20.9 7.3,23.5 7.5,23.7 IC1.14 | 11.6,5.3 11.4,5.1 S1.1 | 11.6,5.3 11.8,5.1 S1.2
BTN2
  Top 0.13: 16.9,5.1 19.4,5.1 19.6,5.3 | 19.6,5.3 19.8,5.1 22.3,5.1 | 19.6,5.3 19.6,20 19,20.6 16.3,20.6 14.2,22.7 IC1.25
  Top 0.16: S2.1 16.89,5.11 16.9,5.1 | 22.3,5.1 S2.2
BTN3
  Top 0.13: 24.9,5.1 27.4,5.1 27.6,5.3 | 27.6,5.3 27.8,5.1 30.25,5.1 | 27.6,5.3 27.6,20 27,20.6 20.2,20.6 19.3,21.5 16.6,21.5 13.9,24.2 IC1.28
  Top 0.16: S3.1 24.89,5.11 24.9,5.1 | 30.25,5.1 S3.2
G_BLOCK0  (via drill 0.25)
  Top 0.13: 11.1,13.4 11.3,13.6 11.3,19.9 11.1,20.1 8.5,20.1 8.2,20.4 7.4,20.4 7,20.8 7,23.6 7.6,24.2 IC1.13 | T5.2 11.1,13.4 | 11.1,13.4 11.3,13.2 11.3,6.7 v11,6.4 | R19.1 v1.1,3.2
  Bottom 0.13: v1.1,3.2 7.8,3.2 v11,6.4
G_BLOCK1  (via drill 0.25)
  Top 0.13: 19.1,13.4 19.3,13.6 19.3,19.9 18.9,20.3 14.2,20.3 12.85,21.65 IC1.24 | T6.2 19.1,13.4 | R20.1 v3.1,1.2 | 19.1,13.4 19.3,13.2 19.3,6.7 19,6.4 v13.6,6.4
  Bottom 0.13: v3.1,1.2 4.5,2.6 8,2.6 11,5.6 12.8,5.6 v13.6,6.4
G_BLOCK2  (via drill 0.25)
  Top 0.13: 27.1,13.4 27.3,13.6 27.3,19.9 26.9,20.3 20.1,20.3 19.2,21.2 16.5,21.2 14,23.7 IC1.27 | T7.2 27.1,13.4 | R21.1 v37.1,2.2 | 27.1,13.4 27.3,13.2 27.3,6.8 v26.9,6.4
  Bottom 0.13: v37.1,2.2 R21.1 31.3,2.9 28.3,5.9 27.4,5.9 v26.9,6.4
G_BLOCK3  (via drill 0.25)
  Top 0.13: 12.1,13.4 11.9,13.6 11.9,19.9 12.35,20.35 IC1.23 | T5.5 12.1,13.4 | R22.1 v2.1,2.2 | 12.1,13.4 11.9,13.2 11.9,6.8 v12.3,6.4
  Bottom 0.13: v2.1,2.2 R22.1 7.9,2.9 10.9,5.9 11.8,5.9 v12.3,6.4
G_BLOCK4  (via drill 0.25)
  Top 0.13: 20.1,13.4 19.9,13.6 19.9,20.1 19.1,20.9 16.4,20.9 14.1,23.2 IC1.26 | T6.5 20.1,13.4 | v36.1,1.2 R23.1 | R23.1 | 20.1,13.4 19.9,13.2 19.9,6.7 20.2,6.4 v25.6,6.4
  Bottom 0.13: v25.6,6.4 26.4,5.6 28.2,5.6 31.2,2.6 34.7,2.6 v36.1,1.2
G_BLOCK5  (via drill 0.25)
  Top 0.13: 28.1,13.4 27.9,13.6 27.9,20.1 27.1,20.9 20.3,20.9 19.4,21.8 16.7,21.8 15,23.5 15,25.1 14.8,25.3 14,25.3 13.9,25.2 IC1.30 | T7.5 28.1,13.4 | v38.1,3.2 R24.1 | R24.1 | 28.1,13.4 27.9,13.2 27.9,6.7 v28.2,6.4
  Bottom 0.13: v28.2,6.4 31.4,3.2 v38.1,3.2
G_LIGHT0  (via drill 0.25)
  Top 0.13: IC1.1 12.85,27.25 13,27.4 13.9,27.4 15.9,25.4 15.9,23.8 17,22.7 19.7,22.7 20.6,21.8 27.4,21.8 28.3,20.9 31.8,20.9 34.4,18.3 34.4,17.2 35.3,16.3 37.6,16.3 v37.8,16.1 38,15.9 38,12.3 37.3,11.6 T1.2 | R2.2 | R2.2 v32.9,7.6
  Bottom 0.13: v37.8,16.1 37.8,15.5 37.6,15.3 37.6,15 37.4,14.8 37.4,11.05 33.95,7.6 v32.9,7.6
G_LIGHT1  (via drill 0.25)
  Top 0.13: T1.5 35.4,11.6 36.4,10.6 37.2,10.6 38.3,11.7 v38.3,16.5 38.2,16.6 35.4,16.6 34.7,17.3 34.7,18.4 31.9,21.2 28.4,21.2 27.5,22.1 20.7,22.1 19.8,23 17.1,23 16.2,23.9 16.2,25.5 14,27.7 12.8,27.7 12.35,27.25 IC1.2 | R3.2 | R3.2 v31.9,6.6
  Bottom 0.13: v38.3,16.5 38.3,15.9 38.1,15.7 38.1,15.4 37.9,15.2 37.9,14.9 37.7,14.7 37.7,10.95 33.35,6.6 v31.9,6.6
G_LIGHT2  (via drill 0.25)
  Top 0.13: IC1.31 14.8,25.7 15.3,25.2 15.3,23.6 16.8,22.1 19.5,22.1 20.4,21.2 27.2,21.2 28.1,20.3 31.6,20.3 33.8,18.1 33.8,17 35.1,15.7 36.4,15.7 v36.8,15.3 36.9,15.3 37.4,14.8 37.4,14.2 37.2,14 T2.2 | R13.2 | R13.2 v34.9,9.6
  Bottom 0.13: v36.8,15.3 36.8,11.25 35.15,9.6 v34.9,9.6
G_LIGHT3  (via drill 0.25)
  Top 0.13: IC1.32 14.7,26.2 15.6,25.3 15.6,23.7 16.9,22.4 19.6,22.4 20.5,21.5 27.3,21.5 28.2,20.6 31.7,20.6 34.1,18.2 34.1,17.1 35.2,16 37,16 v37.3,15.7 37.7,15.3 37.7,13.5 37.2,13 36.4,13 35.4,14 T2.5 | R14.2 | R14.2 v33.9,8.6
  Bottom 0.13: v37.3,15.7 37.3,15.1 37.1,14.9 37.1,11.15 34.55,8.6 v33.9,8.6
G_LIGHT4  (via drill 0.25)
  Top 0.13: T3.2 3.8,11.6 2.4,13 2,13 1.5,13.5 1.5,14.9 3.8,17.2 v3.8,17.8 3.8,18.3 6.1,20.6 6.1,23.9 7.9,25.7 IC1.10 | R15.2 v5.3,8.6
  Bottom 0.13: v5.3,8.6 5.3,9.3 4.6,10 4.6,16.7 3.8,17.5 v3.8,17.8
G_LIGHT5  (via drill 0.25)
  Top 0.13: T3.5 2,11.6 1.2,12.4 1.2,15 3.1,16.9 v3.1,17.8 3.1,18 5.8,20.7 5.8,24 8,26.2 IC1.9 | R16.2 v4.3,9.6
  Bottom 0.13: v4.3,9.6 4.3,16.6 v3.1,17.8
G_LIGHT6  (via drill 0.25)
  Top 0.13: T4.2 3.8,14 3.5,14.3 3.5,16.1 v5.2,17.8 5.2,18.9 6.7,20.4 6.7,23.7 7.7,24.7 IC1.12 | R17.2 v7.3,6.6
  Bottom 0.13: v7.3,6.6 7.3,8.1 5.2,10.2 v5.2,17.8
G_LIGHT7  (via drill 0.25)
  Top 0.13: T4.5 2,14 1.8,14.2 1.8,14.8 4.5,17.5 v4.5,17.8 4.5,18.6 6.4,20.5 6.4,23.8 7.8,25.2 IC1.11 | R18.2 v6.3,7.6
  Bottom 0.13: v6.3,7.6 6.3,8.7 4.9,10.1 4.9,16.8 4.5,17.2 v4.5,17.8
GND  (via drill 0.35, 0.55)  (47 unrouted)
  Top 0.2: T2.1 36.47,13.46 36.07,13.87 36.07,14.33 v36,14.4 | T1.1 36.47,11.06 36.02,11.52 36.02,11.98 v36,12 | T4.4 2.73,14.54 3.18,14.08 3.18,13.62 v3.2,13.6 | T3.4 2.73,12.14 3.18,11.68 3.18,11.22 v3.2,11.2 | v11.1,24.45 10.85,24.7 IC1.5 | v11.8,25.15 11.85,25.2 IC1.3 11.85,27.35 12.45,27.95 | IC1.21 11.35,23.3 | C4.2 32.09,26.44 U2.1 30.06,26.44 30,26.5
  Route15 0.2: 9.6,22.95 v10.4,23.75 | v10.4,23.75 v11.1,24.45 | v11.1,24.45 v11.8,25.15 | v11.8,25.15 12.6,25.95 | v11.1,24.45 v10.4,25.15 | v10.4,25.15 9.6,25.95 | v11.1,24.45 v11.8,23.75 | v11.8,23.75 12.6,22.95 | v11.8,23.75 12.5,24.45 v11.8,25.15 | v11.8,23.75 11.1,23.05 v10.4,23.75 | v10.4,23.75 9.7,24.45 v10.4,25.15 | v10.4,25.15 11.1,25.85 v11.8,25.15
  other vias: 23.6,13.4 15.6,13.4 11.35,21.15 23.4,25 20.3,27.7 22.2,27.7 29.6,25.7 30.4,25.7 32,29.3 37,20.5
  pour Route15: 0,0 39.2,0 39.2,30.1 0,30.1
  pour Top (rank 6): 0,0 39.2,0 39.2,30.1 0,30.1
  cutout Route15 (isolate 1): 9.8,23.25 12.4,23.25 12.4,25.75 9.8,25.75
  pour Bottom: 10,23.35 12.2,23.35 12.2,25.55 10,25.55
L
  Top 0.2: U2.5 28,27.1 27.7,26.8 L1.2
LIGHT0  (via drill 0.35, 0.5)
  Top 0.16: D29.P$2 14.8,7.4 v15.2,7 | D37.P$2 22.8,7.4 v23.2,7 | D45.P$2 30.8,7.4 v31.2,7 31.2,7.6 31.8,8.2 31.8,8.4 R5.2 | D5.P$2 14.8,15.2 v15.2,14.8 | D13.P$2 22.8,15.2 v23.2,14.8 | D21.P$2 30.8,15.2 v31.2,14.8 31.2,15.3 v33.2,17.3
  Route2 0.16: v2.6,24.55 2.9,24.25 2.9,21.9 4.45,20.35 8.2,20.35 13.75,14.8 v15.2,14.8
  Bottom 0.16: v15.2,14.8 v23.2,14.8 v31.2,14.8 | v15.2,7 v23.2,7 v31.2,7 31.2,7.59 31.8,8.19 31.8,9.1 32.2,9.5 32.2,10.3 32.6,10.7 32.6,12.5 32.4,12.7 32.4,13.6 33,14.2 33,17.1 v33.2,17.3
LIGHT1  (via drill 0.35, 0.5)
  Top 0.16: D30.P$2 14.8,8.8 v15.2,8.4 | D38.P$2 22.8,8.8 v23.2,8.4 | D46.P$2 30.8,8.8 v31.2,8.4 31.2,9 31.8,9.6 31.8,10.3 R6.2 | D6.P$2 14.8,16.6 v15.2,16.2 | D14.P$2 22.8,16.6 v23.2,16.2 | D22.P$2 30.8,16.6 v31.2,16.2 31.2,16.7 v32.8,18.3
  Route2 0.16: v15.2,16.2 12.85,16.2 8.35,20.7 4.6,20.7 3.25,22.05 3.25,25 v2.6,25.65
  Bottom 0.16: v15.2,16.2 v23.2,16.2 v31.2,16.2 | v15.2,8.4 v23.2,8.4 v31.2,8.4 31.2,8.99 31.8,9.59 31.8,10.4 32.2,10.8 32.2,12.4 32,12.6 32,13.7 32.6,14.3 32.6,18.1 v32.8,18.3
LIGHT2  (via drill 0.35, 0.5)
  Top 0.16: D31.P$2 14.8,10.2 v15.2,9.8 | D39.P$2 22.8,10.2 v23.2,9.8 | D47.P$2 30.8,10.2 v31.2,9.8 31.2,10.9 31.8,11.5 31.8,12.2 R7.2 | D7.P$2 14.8,18 v15.2,17.6 | D15.P$2 22.8,18 v23.2,17.6 | D23.P$2 30.8,18 v31.2,17.6 31.2,18.1 v32.1,19
  Bottom 0.16: v15.2,17.6 v23.2,17.6 v31.2,17.6 | v15.2,9.8 v23.2,9.8 v31.2,9.8 31.2,10.3 31.8,10.9 31.8,12.3 31.6,12.5 31.6,13.8 32.2,14.4 32.2,18.9 v32.1,19 31.95,19 31.4,19.55 31,19.55 30.8,19.35 25,19.35 24.9,19.45 24.9,20.05 24.45,20.5 24.35,20.6 23.65,20.6 23.55,20.5 16.45,20.5 16.35,20.6 15.65,20.6 15.55,20.5 8.55,20.5 8.35,20.7 7.65,20.7 7.5,20.55 3.8,20.55 3.6,20.75 3.6,27.95 3.05,28.5 2.15,28.5 1.95,28.3 1.95,27.4 v2.6,26.75
LIGHT3  (via drill 0.35, 0.5)
  Top 0.16: D32.P$2 14.8,11.6 v15.2,11.2 | D40.P$2 22.8,11.6 v23.2,11.2 | D48.P$2 30.8,11.6 v31.2,12 31.2,13.5 R8.2 | D8.P$2 14.8,19.4 v15.2,19 | D16.P$2 22.8,19.4 v23.2,19 | D24.P$2 30.8,19.4 v31.2,19
  Bottom 0.16: v15.2,19 v23.2,19 24.55,19 | 24.55,19 v31.2,19 31.2,18.5 31.8,17.9 31.8,14.5 31.2,13.9 v31.2,12 30.4,11.2 v23.2,11.2 v15.2,11.2 | v2.6,27.85 3.25,27.2 3.25,20.6 3.65,20.2 7.65,20.2 7.8,20.35 8.2,20.35 8.4,20.15 15.7,20.15 15.8,20.25 16.2,20.25 16.3,20.15 23.7,20.15 23.8,20.25 24.2,20.25 24.55,19.9 24.55,19
LIGHT4  (via drill 0.35, 0.5)
  Top 0.16: D25.P$2 8.4,7.4 v8,7.8 7.9,7.8 R9.2 | D33.P$2 16.4,7.4 v16,7.8 | D41.P$2 24.4,7.4 v24,7.8 | D1.P$2 8.4,15.2 v8,15.6 v6,17.6 | D9.P$2 16.4,15.2 v16,15.6 | D17.P$2 24.4,15.2 v24,15.6
  Bottom 0.16: v8,15.6 v16,15.6 v24,15.6 | v24,7.8 v16,7.8 v8,7.8 8,8.3 7.4,8.9 7.4,9.8 7,10.2 7,11.1 6.2,11.9 6.2,17.4 v6,17.6 6,18.2 5.4,18.8 3.45,18.8 1.6,20.65 1.6,24.25 v1.3,24.55
LIGHT5  (via drill 0.35, 0.5)
  Top 0.16: D26.P$2 8.4,8.8 v8,9.2 8,9.6 R10.2 | D34.P$2 16.4,8.8 v16,9.2 | D42.P$2 24.4,8.8 v24,9.2 | D2.P$2 8.4,16.6 v8,17 v6.4,18.6 | D10.P$2 16.4,16.6 v16,17 | D18.P$2 24.4,16.6 v24,17
  Bottom 0.16: v8,17 v16,17 v24,17 | v24,9.2 v16,9.2 v8,9.2 8,9.7 7.4,10.3 7.4,11.2 6.6,12 6.6,18.4 v6.4,18.6 5.85,19.15 3.6,19.15 1.95,20.8 1.95,25 v1.3,25.65
LIGHT6  (via drill 0.35, 0.5)
  Top 0.16: D27.P$2 8.4,10.2 v8,10.6 8,11.1 7.4,11.7 7.4,12.1 R11.2 | D35.P$2 16.4,10.2 v16,10.6 | D43.P$2 24.4,10.2 v24,10.6 | D3.P$2 8.4,18 v8,18.4 v7.1,19.3 | D11.P$2 16.4,18 v16,18.4 | D19.P$2 24.4,18 v24,18.4
  Route2 0.16: v7.1,19.3 6.75,19.65 4.15,19.65 2.2,21.6 2.2,23.55 1.9,23.85 1.1,23.85 0.65,24.3 0.65,26.1 v1.3,26.75
  Bottom 0.16: v8,18.4 v16,18.4 v24,18.4 | v24,10.6 v16,10.6 v8,10.6 8,11.1 7,12.1 7,19.2 v7.1,19.3 | v1.3,26.74 v1.3,26.75
LIGHT7  (via drill 0.35, 0.5)
  Top 0.16: D28.P$2 8.4,11.6 v8,12 8,13.4 R12.2 | D36.P$2 16.4,11.6 v16,12 | D44.P$2 24.4,11.6 v24,12 | D4.P$2 8.4,19.4 v8,19.8 | D12.P$2 16.3,19.4 v16,19.7 | D20.P$2 24.3,19.4 v24,19.7
  Route2 0.16: v1.3,27.85 1.95,27.2 1.95,24.3 2.55,23.7 2.55,21.75 4.3,20 7.8,20 v8,19.8
  Bottom 0.16: v24,19.7 23.9,19.8 16.1,19.8 v16,19.7 15.9,19.8 v8,19.8 8,19.3 7.4,18.7 7.4,12.6 v8,12 v16,12 v24,12
MISO  (via drill 0.35)  (7 unrouted)
  Top 0.13: IC1.16 8.4,22.7 v7.9,22.2
MOSI  (via drill 0.35)
  Top 0.13: IC1.15 8,23.2 v7.9,23.1
PROG
  Top 0.13: U1.5 37.94,17.69 R1.2
R_LIGHT0
  Top 0.16: T1.6 34.46,11.06 R5.1
R_LIGHT1
  Top 0.16: T1.3 36.76,12.14 36.2,12.7 34.2,12.7 R6.1
R_LIGHT2
  Top 0.16: T2.6 34.34,13.46 R7.1
R_LIGHT3
  Top 0.16: T2.3 36.1,15.3 34.4,15.3 R8.1
R_LIGHT4
  Top 0.16: T3.6 3.1,10.3 R9.1
R_LIGHT5
  Top 0.16: T3.3 5.34,12.14 R10.1
R_LIGHT6
  Top 0.16: T4.6 2.44,13.46 3.1,12.8 4.6,12.8 5.4,13.6 R11.1
R_LIGHT7
  Top 0.16: T4.3 5.4,15.89 R12.1
RST  (via drill 0.35)
  Top 0.13: v14.4,24.7 IC1.29
SCK  (via drill 0.35)  (4 unrouted)
  Top 0.13: IC1.17 8.55,21.3 v7.9,21.3
STAT
  Top 0.16: U1.1 37.94,23.34 STAT_LED.P$2
STAT_R
  Top 0.16: STAT_LED.P$1 35.05,23.5 R4.2
VBATT
  Top 0.2: U1.3 36.06,22.56 | 36.06,22.56 36.3,22.8 36.8,22.8 37,23 37,24.85 BATT1.P$1 36.45,26.4 C3.1 | U3.3 33.3,23.4 34.2,22.5 36,22.5 36.06,22.56
VBUS
  Top 0.2: U1.4 36.06,19.54 34.9,20.7 R4.1 34.85,21.65 34.45,22.05 32.15,22.05 | 30.8,24.34 U3.1 | 30.8,24.34 29.54,24.34 D49.A 27.85,24.2 C2.1 | 30.8,24.34 30.9,24.24 30.9,23.9 32.15,22.65 32.15,22.05 | 24.25,22.6 24.15,22.5 20.85,22.5 19.95,23.4 J1.1 | 24.25,22.6 R25.2 | 24.25,22.6 24.35,22.5 27.65,22.5 28.55,21.6 31.7,21.6 32.15,22.05
VCC  (via drill 0.35)  (12 unrouted)
  Top 0.2: U2.2 U2.3 31.71,27.76 C4.1 32.2,28.4 32.4,28.4 v33.3,29.3 v34,29.3 35.5,29.3 C5.1 | IC1.4 v11.35,27.7 | IC1.6 v10.35,27.7 | IC1.20 10.85,21.65 v10.35,21.15 | IC1.18 9.85,21.65 v9.35,21.15 | v16.8,13.4 17.7,13.4 18.2,13.9 18.7,13.9 18.74,13.94 T6.1 | v14.4,13.4 13.5,13.4 13,12.9 12.5,12.9 12.46,12.86 T5.4 | v24.8,13.4 25.7,13.4 26.2,13.9 26.71,13.9 T7.1 | v22.4,13.4 21.5,13.4 21,12.9 20.49,12.9 T6.4 | v30.4,13.4 29.5,13.4 29,12.9 28.49,12.9 T7.4 | v8.8,13.4 9.7,13.4 10.2,13.9 10.7,13.9 10.74,13.94 T5.1 | R20.2 R22.2 R19.2 v2.2,5.9 | v37,5.9 R24.2 R21.2 R23.2
  pour Route2: 0,0 39.2,0 39.2,30.1 0,30.1
  pour Bottom (rank 6): 0,0 39.2,0 39.2,30.1 0,30.1
  pour Bottom (isolate 0.024): 16.77,0.7 22.47,0.7 22.47,6.39 16.77,6.39
VIN
  Top 0.2: U3.2 29.54,22.46 D49.K 28.5,23.5 27.05,23.5 26.9,23.65 26.9,25.1 | U2.4 28.59,27.76 L1.1 | L1.1 26.7,27.65 26.7,25.3 26.9,25.1 | 26.9,25.1 28.5,25.1 28.95,25.55 28.95,26.4 U2.6 | L1.1 28.2,29.15 C6.1
XTAL_N
  Top 0.15: IC1.8 9.43,26.88 9.43,27.43 9.08,27.77 7.65,27.77 | 7.65,27.77 6.92,27.77 6.42,27.27 4.65,27.27 4.45,27.07 Q1.2 | C1.1 7.65,26.95 7.65,27.77
XTAL_P
  Top 0.15: IC1.7 9.78,26.88 9.78,27.57 9.22,28.12 6.78,28.12 6.28,27.62 4.65,27.62 4.45,27.82 Q1.1

### Text on the board
tPlace: Do not print this layer. / Instead, use layer Document for Top Silkscreen
bPlace: Li-Ion | - | + | Top | Bottom | RST | MOSI | ISP | github/programagor/uChronos | MISO | Vcc | GND | SCK | μChronos | v0.6.3 | Author: Jiri Bednar | F | L | E | K | D | J | C | I | B | H | A | G | R | Q | P | O | N | M | X | W | V | U | T | S | ! | ? | . | , | Z | Y | 3. / 243F 6A88 85A3 08D3 1319 8A2E 0370 7344 / A409 3822 299F 31D0 082E FA98 EC4E 6C89 / 4528 21E6 38D0 1377 BE54 66CF 34E9 0C6C / C0AC 29B7 C97C 50DD 3F84 D5B5 B547 0917 / 9216 D5D9 8979 FB1B D131 0BA6 98DF B5AC / 2FFD 72DB D01A DFB7 B8E1 AFED 6A26 7E96 / BA7C 9045 F12C 7F99 24A1 9947 B391 6CF7 / 0801 F2E2 858E FC16 6369 20D8 7157 4E69
Document: from Jiri | with / much love